# EAGLE design Flashlight (EAGLE 9.1.1)
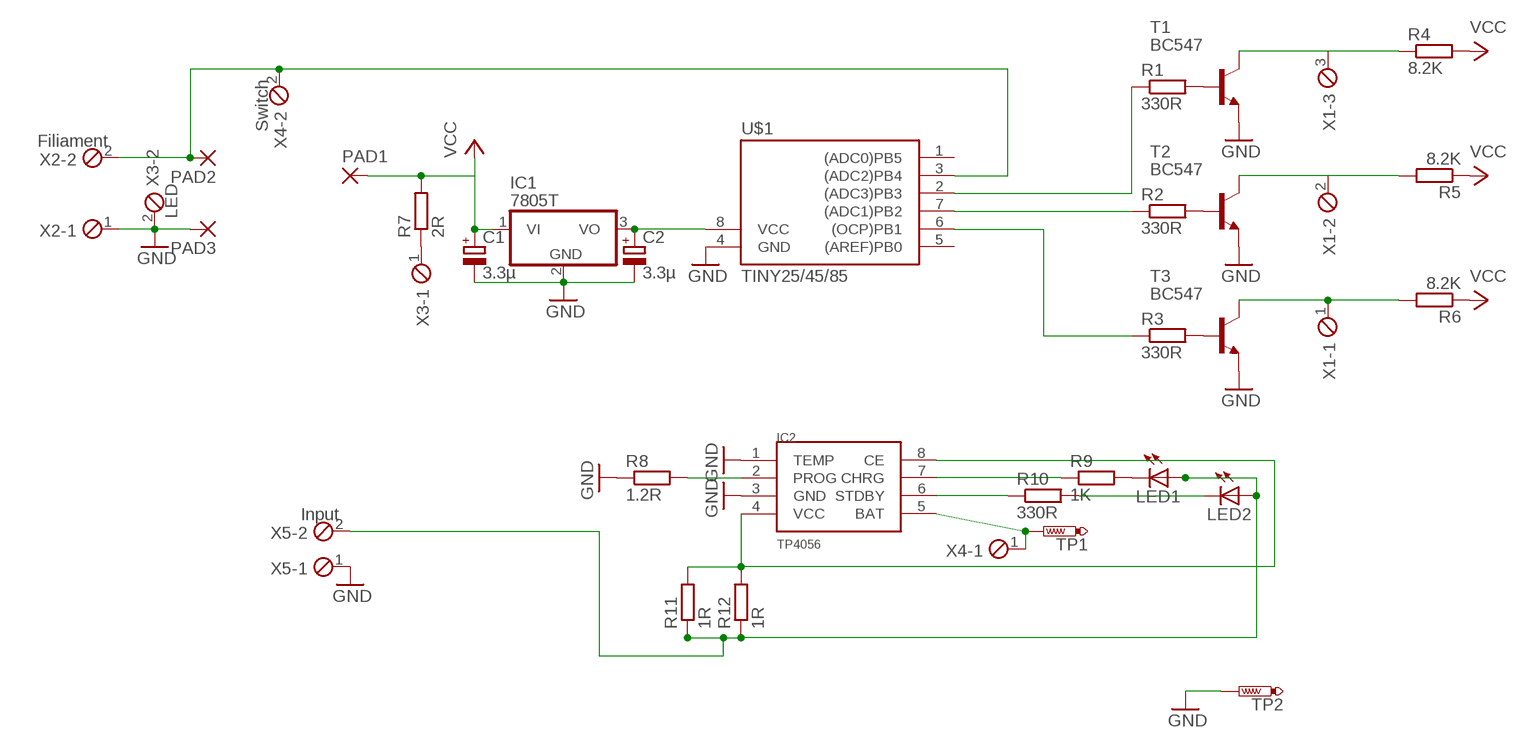
[diagram p0: schematic, sheet 1]

## Parts
C1  3.3µ  CPOL-EUE2.5-6  [E2,5-6]
C2  3.3µ  CPOL-EUE2.5-6  [E2,5-6]
IC1  7805T  [TO220H]
IC2  TP4056  [SOP-8]
LED1  LED3MM  [LED3MM]
LED2  LED3MM  [LED3MM]
PAD1  3,81/1,3  [3,81/1,3]
PAD2  3,81/1,3  [3,81/1,3]
PAD3  3,81/1,3  [3,81/1,3]
R1  330R  R-EU_R1206  [R1206]
R2  330R  R-EU_R1206  [R1206]
R3  330R  R-EU_R1206  [R1206]
R4  8.2K  R-EU_R1206  [R1206]
R5  8.2K  R-EU_R1206  [R1206]
R6  8.2K  R-EU_R1206  [R1206]
R7  2R  R-EU_0411/12  [0411/12]
R8  1.2R  R-EU_M1206  [M1206]
R9  1K  R-EU_M1206  [M1206]
R10  330R  R-EU_M1206  [M1206]
R11  1R  R-EU_M1206  [M1206]
R12  1R  R-EU_M1206  [M1206]
T1  BC547  [TO92]
T2  BC547  [TO92]
T3  BC547  [TO92]
TP1  PTR1PAD1-13  [P1-13]
TP2  PTR1PAD1-13  [P1-13]
U$1  TINY25/45/85  [DIL08]
X1  MPT3  [3POL254]
X2  Filiament  MPT2  [2POL254]
X3  LED  MPT2  [2POL254]
X4  Switch  MPT2  [2POL254]
X5  Input  MPT2  [2POL254]

## Nets
GND: C1.- C2.- IC1.2(GND) IC2.1(TEMP) IC2.3(GND) PAD3.1(P) R8.1 T1.1(E) T2.1(E) T3.1(E) TP2.TP U$1.4(GND) X2.1 X3.2 X5.1
N$1: R1.2 T1.2(B)
N$2: R2.2 T2.2(B)
N$3: R3.2 T3.2(B)
N$4: R4.1 T1.3(C) X1.3
N$5: R5.2 T2.3(C) X1.2
N$6: R6.2 T3.3(C) X1.1
N$7: PAD2.1(P) U$1.3((ADC2)PB4) X2.2 X4.2
N$8: R7.1 X3.1
N$9: IC2.7(CHRG) R9.1
N$10: R3.1 U$1.6((OCP)PB1)
N$11: R2.1 U$1.7((ADC1)PB2)
N$12: R1.1 U$1.2((ADC3)PB3)
N$13: C2.+ IC1.3(VO) U$1.8(VCC)
N$14: IC2.6(STDBY) R10.1
N$15: IC2.2(PROG) R8.2
N$16: IC2.4(VCC) IC2.8(CE) R11.2 R12.2
N$17: IC2.5(BAT) TP1.TP X4.1
N$20: LED1.K(C) R9.2
N$21: LED2.K(C) R10.2
N$22: LED1.A LED2.A R11.1 R12.1 X5.2
VCC: C1.+ IC1.1(VI) PAD1.1(P) R4.2 R5.1 R6.1 R7.2
Unconnected: U$1.1((ADC0)PB5) U$1.5((AREF)PB0)

## Library data of the parts
C1 C2 = resistor:CPOL-EU: POLARIZED CAPACITOR, European symbol
IC1 = linear:78*: Positive VOLTAGE REGULATOR Source: http://cache.national.com/ds/LM/LM78L05.pdf http://www.fairchildsemi.com/ds/LM/LM7805.pdf
IC2 = TP4056:TP4056
LED1 LED2 = led:LED: LED OSRAM: - CHIPLED LG R971, LG N971, LY N971, LG Q971, LY Q971, LO R971, LY R971 LH N974, LH R974 LS Q976, LO Q976, LY Q976 LO Q996 - Hyper CHIPLED LW Q18S LB Q993, LB Q99A, LB R99A - SideLED LS A670, LO A670, LY A670, LG A670, LP A670 LB A673, LV A673, LT A673, LW A673 LH A674 LY A675 LS A676, LA A676, LO A676, LY A676, LW A676 LS A679, LY A679, LG A679 - Hyper Micro SIDELED® LS Y876, LA Y876, LO Y876, LY Y876 LT Y87S - SmartLED LW L88C, LW L88S LB L89C, LB L89S, LG L890 LS L89K, LO L89K, LY L89K LS L896, LA L896, LO L896, LY L896 - TOPLED LS T670, LO T670, LY T670, LG T670, LP T670 LSG T670, LSP T670, LSY T670, LOP T670, LYG T670 LG T671, LOG T671, LSG T671 LB T673, LV T673, LT T673, LW T673 LH T674 LS T676, LA T676, LO T676, LY T676, LB T676, LH T676, LSB T676, LW T676 LB T67C, LV T67C, LT T67C, LS T67K, LO T67K, LY T67K, LW E67C LS E67B, LA E67B, LO E67B, LY E67B, LB E67C, LV E67C, LT E67C LW T67C LS T679, LY T679, LG T679 LS T770, LO T770, LY T770, LG T770, LP T770 LB T773, LV T773, LT T773, LW T773 LH T774 LS E675, LA E675, LY E675, LS T675 LS T776, LA T776, LO T776, LY T776, LB T776 LHGB T686 LT T68C, LB T68C - Hyper Mini TOPLED® LB M676 - Mini TOPLED Santana® LG M470 LS M47K, LO M47K, LY M47K Source: http://www.osram.convergy.de LUXEON: - LUMILED® LXK2-PW12-R00, LXK2-PW12-S00, LXK2-PW14-U00, LXK2-PW14-V00 LXK2-PM12-R00, LXK2-PM12-S00, LXK2-PM14-U00 LXK2-PE12-Q00, LXK2-PE12-R00, LXK2-PE12-S00, LXK2-PE14-T00, LXK2-PE14-U00 LXK2-PB12-K00, LXK2-PB12-L00, LXK2-PB12-M00, LXK2-PB14-N00, LXK2-PB14-P00, LXK2-PB14-Q00 LXK2-PR12-L00, LXK2-PR12-M00, LXK2-PR14-Q00, LXK2-PR14-R00 LXK2-PD12-Q00, LXK2-PD12-R00, LXK2-PD12-S00 LXK2-PH12-R00, LXK2-PH12-S00 LXK2-PL12-P00, LXK2-PL12-Q00, LXK2-PL12-R00 Source: www.luxeon.com KINGBRIGHT: KA-3528ASYC Source: www.kingbright.com
PAD1-PAD3 = wirepad:3,81/1,3: THROUGH-HOLE PAD
R1-R12 = resistor:R-EU_: RESISTOR, European symbol
T1-T3 = transistor-neu-to92:BC547: NPN TRANSISTOR
TP1 TP2 = testpad:PTR1: TEST PIN
U$1 = avr-6:TINY25/45/85
X1 = con-phoenix-254:MPT3: PHOENIX CONNECTOR; OC_FARNELL: unknown; OC_NEWARK: unknown
X2-X5 = con-phoenix-254:MPT2: PHOENIX CONNECTOR; OC_FARNELL: unknown; OC_NEWARK: unknown

## Board
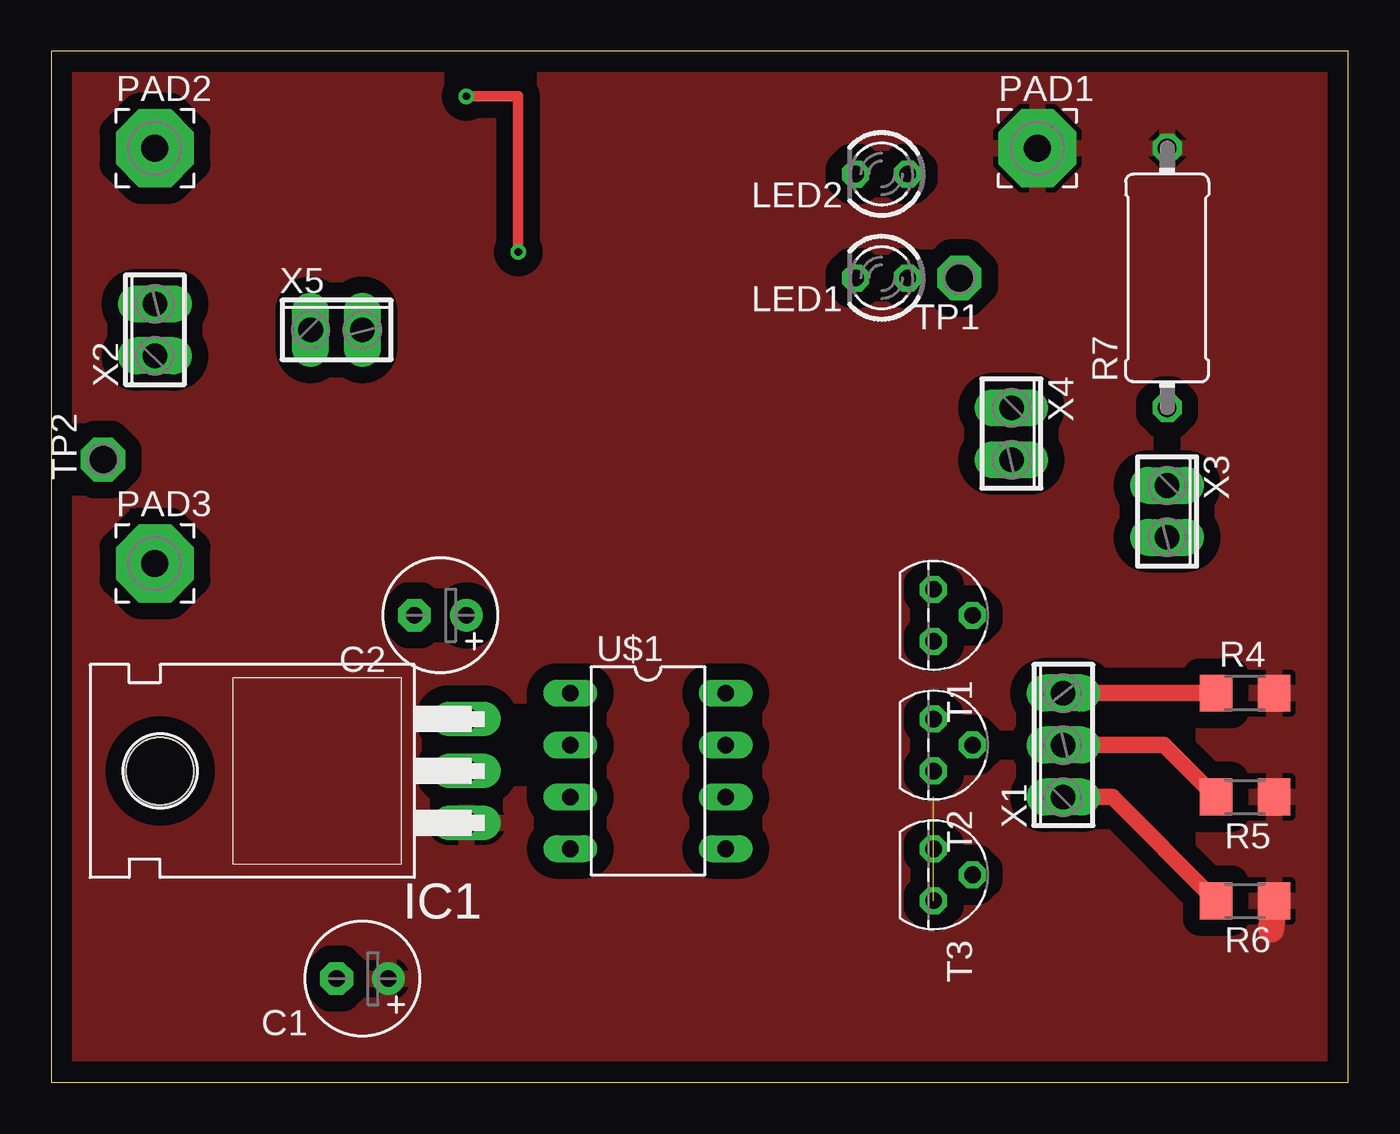
[diagram p1: board, top side]
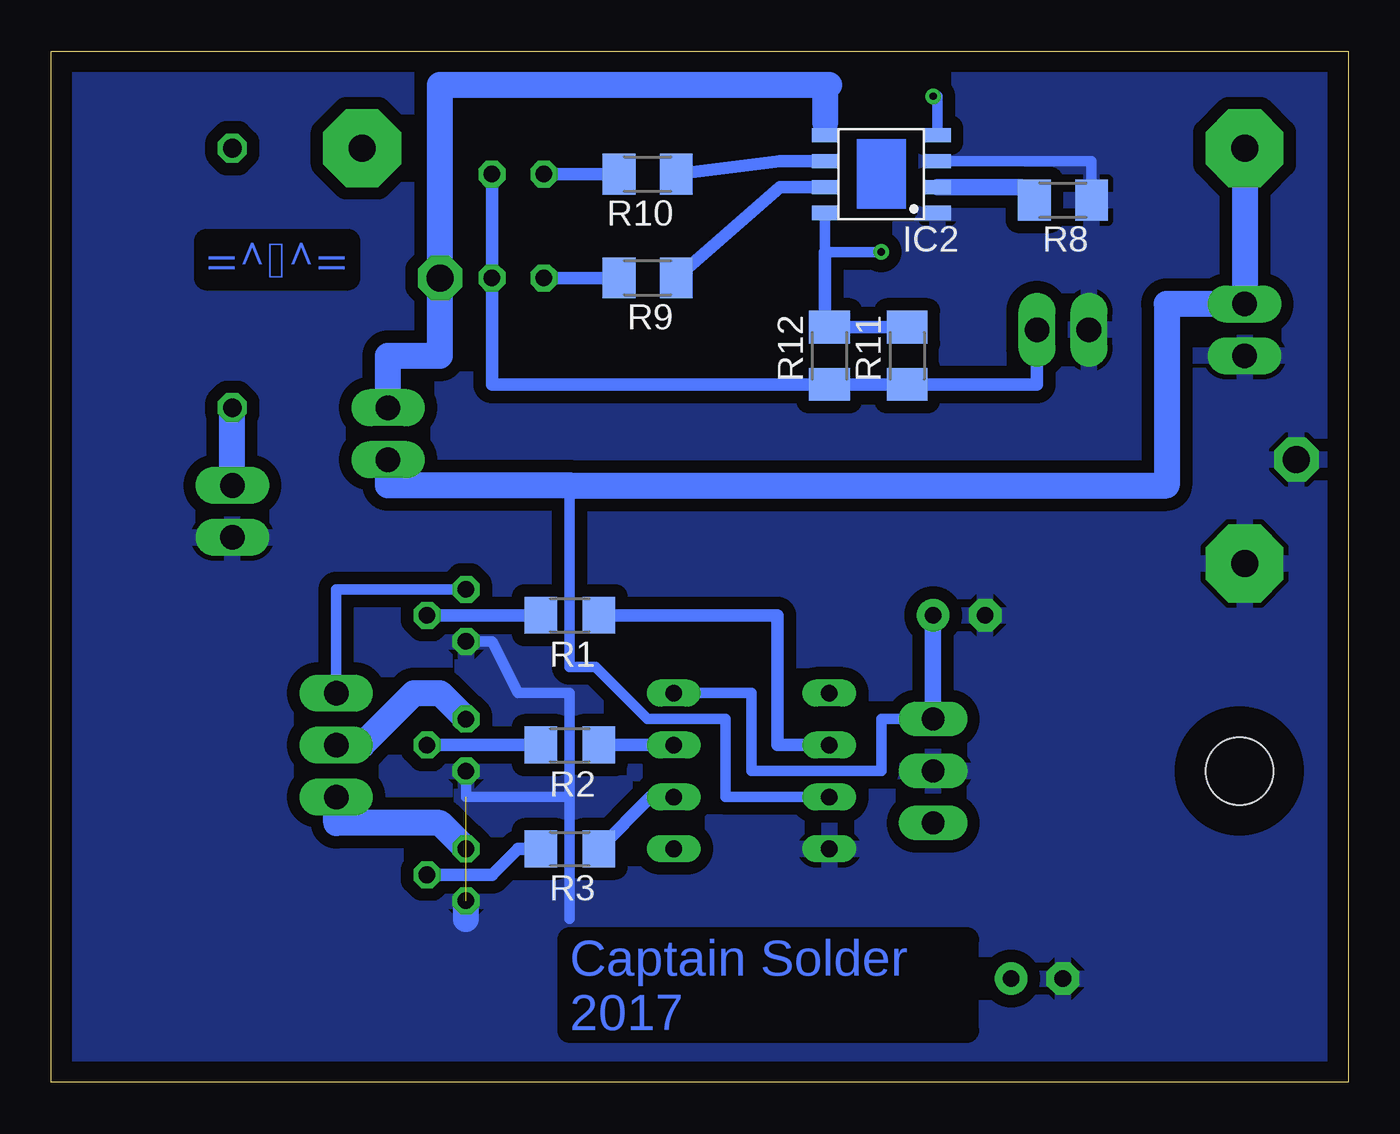
[diagram p2: board, bottom side, seen from below]

Size 63.48 x 50.47 mm. Coordinates in mm from the lower left corner, seen from the top.
Outline: 0,0 63.48,0 63.48,50.47 0,50.47 0,0
Copper layers (1*16): Top 0.035mm / dielectric 1.5mm / Bottom 0.035mm
Design rules "default": minimum track width 6mil, minimum drill 0.35mm, track to track 6mil, track to pad 6mil, pad to pad 6mil, via to via 6mil, smd to smd 6mil, copper to edge 40mil, drill to drill 6mil, minimum pad ring 10mil, minimum via ring 8mil, stop-mask expansion 4mil, vias tented up to drill 0mil, thermal gap 10mil

### Footprints (pad centres in the part's own frame; a part is rotated, then mirrored left to right if it is on the bottom)
E2,5-6 = drill 0.813 pad 1.6: + -1.27,0 | drill 0.813 pad 1.6 octagon: - 1.27,0
TO220H = drill 1.118 long: 1 -2.54,-10.16; 2 0,-10.16; 3 2.54,-10.16 | hole 3.302: 0,4.826
SOP-8 = smd 1.3 x 0.7: 1 -2.75,1.905; 2 -2.75,0.635; 3 -2.75,-0.635; 4 -2.75,-1.905; 5 2.75,-1.905; 6 2.75,-0.635; 7 2.75,0.635; 8 2.75,1.905
LED3MM = drill 0.813 octagon: A -1.27,0; K 1.27,0
3,81/1,3 = drill 1.321 pad 3.81 octagon: 1 0,0
R1206 = smd 1.6 x 1.803: 1 -1.422,0; 2 1.422,0
0411/12 = drill 0.914 octagon: 1 -6.35,0; 2 6.35,0
M1206 = smd 1.6 x 2: 1 -1.4,0; 2 1.4,0
TO92 = drill 0.813 octagon: 1 1.27,0; 2 0,1.905; 3 -1.27,0
P1-13 = drill 1.321 pad 2.159 octagon: TP 0,0
DIL08 = drill 0.813 long: 1 -3.81,-3.81; 2 -1.27,-3.81; 3 1.27,-3.81; 4 3.81,-3.81; 5 3.81,3.81; 6 1.27,3.81; 7 -1.27,3.81; 8 -3.81,3.81
3POL254 = drill 1.2 long: 1 -2.54,0; 2 0,0; 3 2.54,0
2POL254 = drill 1.2 long: 1 -1.27,0; 2 1.27,0

### Placement (x,y rotation side)
C1  15.24,5.08 180 top
C2  19.05,22.86 180 top
IC1  10.16,15.24 90 top
IC2  22.86,44.45 180 bottom
LED1  40.64,39.37 180 top
LED2  40.64,44.45 180 top
PAD1  48.26,45.72 0 top
PAD2  5.08,45.72 0 top
PAD3  5.08,25.4 0 top
R1  38.1,22.86 180 bottom
R2  38.1,16.51 180 bottom
R3  38.1,11.43 180 bottom
R4  58.42,19.05 0 top
R5  58.42,13.97 180 top
R6  58.42,8.89 180 top
R7  54.61,39.37 90 top
R8  13.97,43.18 180 bottom
R9  34.29,39.37 180 bottom
R10  34.29,44.45 180 bottom
R11  21.59,35.56 90 bottom
R12  25.4,35.56 90 bottom
T1  43.18,22.86 270 top
T2  43.18,16.51 270 top
T3  43.18,10.16 270 top
TP1  44.45,39.37 180 top
TP2  2.54,30.48 90 top
U$1  29.21,15.24 270 top
X1  49.53,16.51 90 top
X2  5.08,36.83 90 top
X3  54.61,27.94 270 top
X4  46.99,31.75 270 top
X5  13.97,36.83 0 top

### Tracks (layer width: path | path; a pad name or v marks a point on that pad's centre or on a via)
GND  (1 unrouted)
  Bottom 0.406: IC2.3 19.68,45.09 | 19.68,45.09
  Bottom 0.508: T1.1 41.91,21.59 40.64,19.05 38.1,19.05 38.1,13.97 | T2.1 43.18,13.97 38.1,13.97 | 38.1,13.97 38.1,8 | IC2.3 12.57,45.09 R8.1
  Bottom 1.27: 43.18,8 T3.1
  pour Bottom (isolate 0.61): 0,50.8 63.5,50.8 63.5,0 0,0
N$1
  Bottom 0.61: R1.2 T1.2
N$2
  Bottom 0.61: R2.2 T2.2
N$3
  Bottom 0.61: R3.2 40.64,11.43 41.91,10.16 T3.2
N$4
  Top 0.813: R4.1 X1.3
  Bottom 0.508: X1.3 49.53,24.13 T1.3
N$5
  Top 0.813: R5.2 54.46,16.51 X1.2
  Bottom 1.27: X1.2 48.26,16.51 45.72,19.05 44.45,19.05 T2.3
N$6
  Top 0.813: R6.2 51.92,13.97 X1.1
  Bottom 1.27: T3.3 44.45,12.7 49.53,12.7 X1.1
N$7
  Bottom 0.508: U$1.3 30.48,13.97 30.48,17.78 34.29,17.78 36.83,20.32 38.1,20.32 38.1,26.67 38.1,29.21
  Bottom 1.27: PAD2.1 X2.2 8.89,38.1 8.89,29.21 38.1,29.21 46.99,29.21 X4.2
N$8
  Bottom 1.27: X3.1 R7.1
N$9
  Bottom 0.61: IC2.7 27.81,43.82 R9.1
N$10
  Bottom 0.61: R3.1 34.14,13.97 U$1.6
N$11
  Bottom 0.61: R2.1 U$1.7
N$12
  Bottom 0.61: R1.1 27.94,22.86 27.94,16.51 U$1.2
N$13
  Bottom 0.508: U$1.8 29.21,19.05 29.21,15.24 22.86,15.24 22.86,17.78 IC1.3
  Bottom 0.813: IC1.3 C2.+
N$14
  Bottom 0.61: R10.1 27.81,45.09 IC2.6
N$15
  Bottom 0.813: IC2.2 16,43.82 R8.2
N$16  (via drill 0.35)
  Top 0.508: v22.86,40.64 22.86,48.26 v20.32,48.26
  Bottom 0.305: IC2.8 25.64,41.27
  Bottom 0.508: 25.61,40.64 IC2.8 25.61,40.64 | 25.61,40.64 v22.86,40.64 | v20.32,48.26 20.11,48.26 IC2.4
  Bottom 0.61: R11.2 R12.2 25.61,36.96 25.61,40.64
N$17
  Bottom 0.61: 25.61,46.99 IC2.5
  Bottom 1.27: X4.1 46.99,35.56 44.45,35.56 TP1.TP 44.45,48.82 25.4,48.82 25.61,48.61 25.61,46.99
N$20
  Bottom 0.61: LED1.K R9.2
N$21
  Bottom 0.61: LED2.K R10.2
N$22
  Bottom 0.61: X5.2 15.24,34.16 R11.1 R12.1 41.91,34.16 LED1.A LED2.A
VCC
  Top 1.27: 59.69,19.05 R4.2 | R6.1 59.69,7.47
  Bottom 0.61: 21.59,12.7 IC1.1
  pour Top (isolate 0.813): -2.54,50.8 63.5,50.8 63.5,0 -2.54,0

### Text on the board
Bottom: =^･^= | Captain Solder / 2017